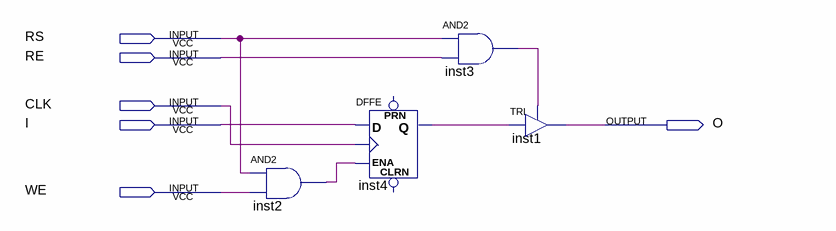
[diagram p0: schematic sheet]
// Quartus schematic MC.bdf as structural Verilog: 4 symbols, 6 pins
module MC (
  input  RS,
  input  RE,
  input  CLK,
  input  I,
  input  WE,
  output O
);

  wire inst2_out, inst3_out, inst4_q;

  and inst2 (inst2_out, RS, WE);
  DFFE inst4 (.D(I), .CLK(CLK), .ENA(inst2_out), .Q(inst4_q));  // open: PRN, CLRN
  and inst3 (inst3_out, RS, RE);
  TRI inst1 (.IN(inst4_q), .OE(inst3_out), .OUT(O));
endmodule
